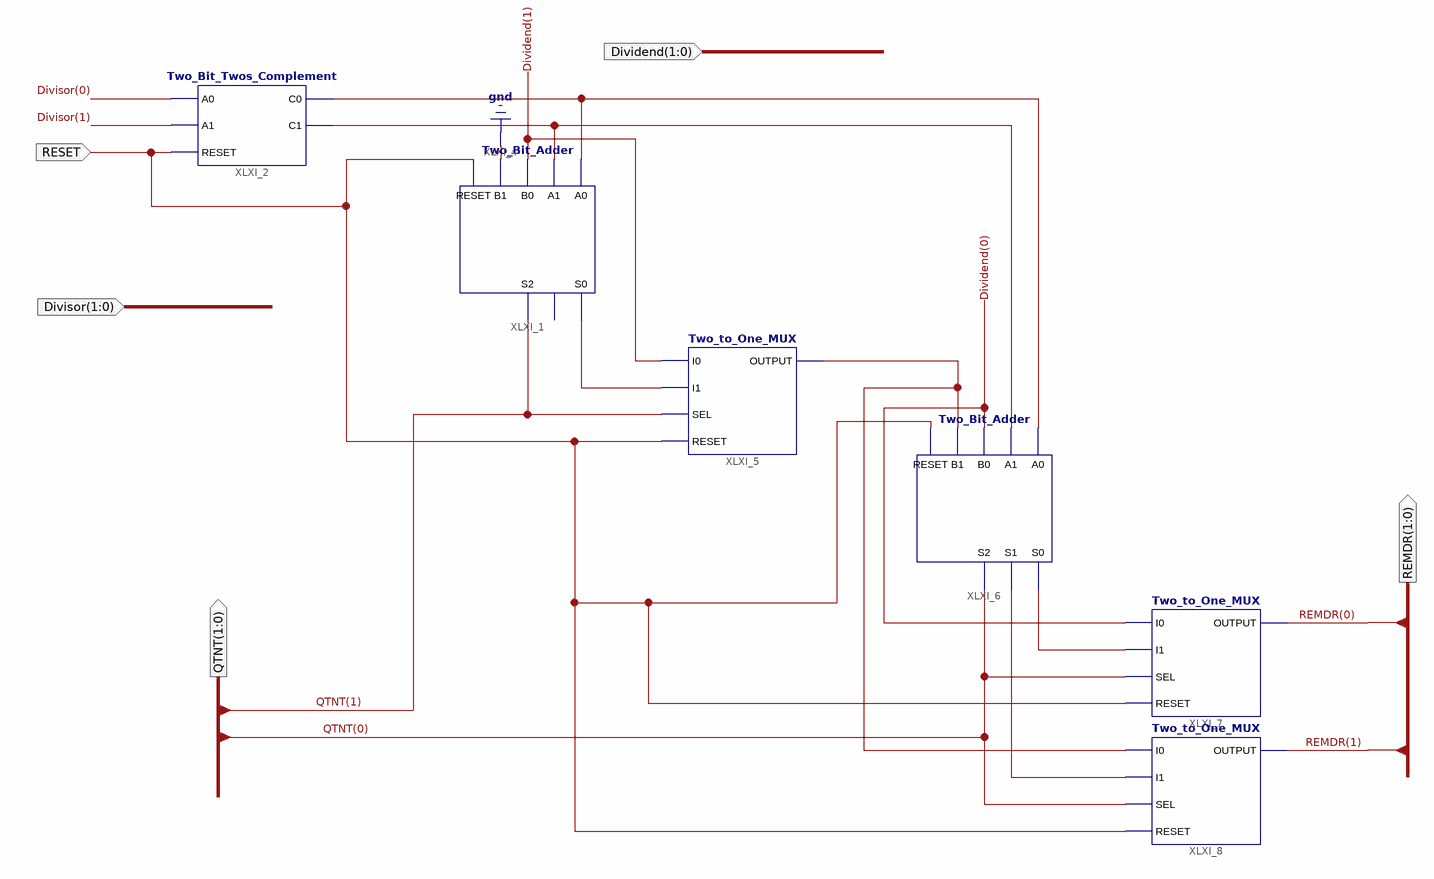
[diagram p0: schematic sheet 1]
// Xilinx ISE schematic Two_Bit_Divider.sch (spartan6) as structural Verilog: 6 symbols, 5 ports
module Two_Bit_Divider (
  input  RESET,
  input  [1:0] Divisor,
  input  [1:0] Dividend,
  output [1:0] REMDR,
  output [1:0] QTNT
);

  wire XLXN_6, XLXN_7, XLXN_11, XLXN_23, XLXN_24, XLXN_25;

  Two_Bit_Adder XLXI_1 (
    .A0(XLXN_6), .A1(XLXN_7), .B0(Dividend[1]), .B1(1'b0), .RESET(RESET), .S0(XLXN_11), .S2(QTNT[1]));  // open: S1
  Two_Bit_Twos_Complement XLXI_2 (.A0(Divisor[0]), .A1(Divisor[1]), .C0(XLXN_6), .C1(XLXN_7), .RESET(RESET));
  Two_to_One_MUX XLXI_5 (.I0(Dividend[1]), .I1(XLXN_11), .OUTPUT(XLXN_25), .RESET(RESET), .SEL(QTNT[1]));
  Two_Bit_Adder XLXI_6 (
    .A0(XLXN_6), .A1(XLXN_7), .B0(Dividend[0]), .B1(XLXN_25), .RESET(RESET), .S0(XLXN_23), .S1(XLXN_24),
    .S2(QTNT[0]));
  Two_to_One_MUX XLXI_7 (.I0(Dividend[0]), .I1(XLXN_23), .OUTPUT(REMDR[0]), .RESET(RESET), .SEL(QTNT[0]));
  Two_to_One_MUX XLXI_8 (.I0(XLXN_25), .I1(XLXN_24), .OUTPUT(REMDR[1]), .RESET(RESET), .SEL(QTNT[0]));
endmodule
